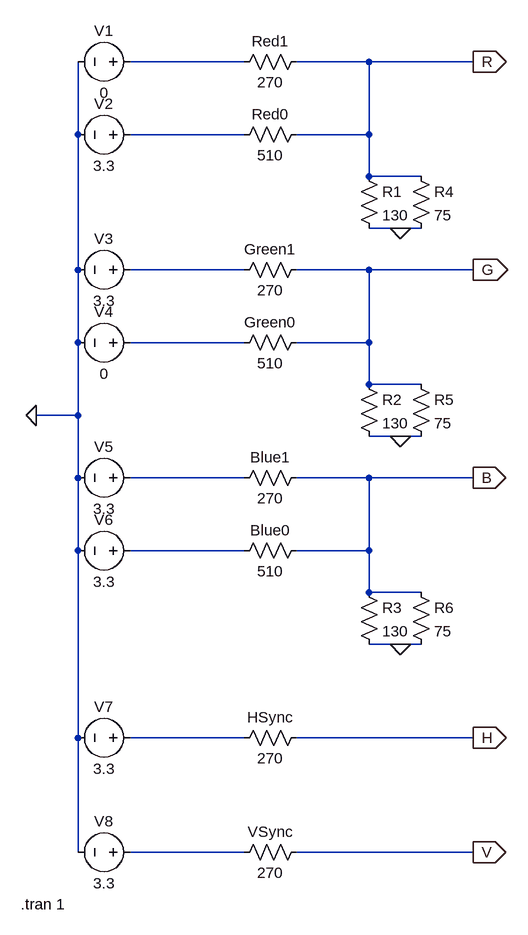
[diagram p0: schematic R-2R_DAC.asc]
R-2R_DAC.asc, the LTspice schematic file:
Version 4
SHEET 1 908 680
WIRE -112 -720 -288 -720
WIRE 80 -720 -32 -720
WIRE 240 -720 80 -720
WIRE -368 -608 -368 -720
WIRE -112 -608 -288 -608
WIRE 80 -608 80 -720
WIRE 80 -608 -32 -608
WIRE 80 -544 80 -608
WIRE 160 -544 80 -544
WIRE 128 -464 80 -464
WIRE 160 -464 128 -464
WIRE -368 -400 -368 -608
WIRE -112 -400 -288 -400
WIRE 80 -400 -32 -400
WIRE 240 -400 80 -400
WIRE -368 -288 -368 -400
WIRE -112 -288 -288 -288
WIRE 80 -288 80 -400
WIRE 80 -288 -32 -288
WIRE 80 -224 80 -288
WIRE 160 -224 80 -224
WIRE -368 -176 -368 -288
WIRE -368 -176 -432 -176
WIRE 128 -144 80 -144
WIRE 160 -144 128 -144
WIRE -368 -80 -368 -176
WIRE -112 -80 -288 -80
WIRE 80 -80 -32 -80
WIRE 240 -80 80 -80
WIRE -368 32 -368 -80
WIRE -112 32 -288 32
WIRE 80 32 80 -80
WIRE 80 32 -32 32
WIRE 80 96 80 32
WIRE 160 96 80 96
WIRE 128 176 80 176
WIRE 160 176 128 176
WIRE -368 320 -368 32
WIRE -112 320 -288 320
WIRE 240 320 -32 320
WIRE -368 496 -368 320
WIRE -112 496 -288 496
WIRE 240 496 -32 496
FLAG 240 -720 R
IOPIN 240 -720 Out
FLAG 240 -400 G
IOPIN 240 -400 Out
FLAG 240 -80 B
IOPIN 240 -80 Out
FLAG 240 320 H
IOPIN 240 320 Out
FLAG 240 496 V
IOPIN 240 496 Out
FLAG -432 -176 0
FLAG 128 -464 0
FLAG 128 -144 0
FLAG 128 176 0
SYMBOL res -16 -736 R90
WINDOW 0 0 56 VBottom 2
WINDOW 3 32 56 VTop 2
SYMATTR InstName Red1
SYMATTR Value 270
SYMBOL res -16 -624 R90
WINDOW 0 0 56 VBottom 2
WINDOW 3 32 56 VTop 2
SYMATTR InstName Red0
SYMATTR Value 510
SYMBOL res 64 -560 R0
SYMATTR InstName R1
SYMATTR Value 130
SYMBOL res -16 -416 R90
WINDOW 0 0 56 VBottom 2
WINDOW 3 32 56 VTop 2
SYMATTR InstName Green1
SYMATTR Value 270
SYMBOL res -16 -304 R90
WINDOW 0 0 56 VBottom 2
WINDOW 3 32 56 VTop 2
SYMATTR InstName Green0
SYMATTR Value 510
SYMBOL res 64 -240 R0
SYMATTR InstName R2
SYMATTR Value 130
SYMBOL res -16 -96 R90
WINDOW 0 0 56 VBottom 2
WINDOW 3 32 56 VTop 2
SYMATTR InstName Blue1
SYMATTR Value 270
SYMBOL res -16 16 R90
WINDOW 0 0 56 VBottom 2
WINDOW 3 32 56 VTop 2
SYMATTR InstName Blue0
SYMATTR Value 510
SYMBOL res 64 80 R0
SYMATTR InstName R3
SYMATTR Value 130
SYMBOL res -16 304 R90
WINDOW 0 0 56 VBottom 2
WINDOW 3 32 56 VTop 2
SYMATTR InstName HSync
SYMATTR Value 270
SYMBOL res -16 480 R90
WINDOW 0 0 56 VBottom 2
WINDOW 3 32 56 VTop 2
SYMATTR InstName VSync
SYMATTR Value 270
SYMBOL voltage -272 -720 R90
WINDOW 0 -32 56 VBottom 2
WINDOW 3 32 56 VTop 2
SYMATTR InstName V1
SYMATTR Value 0
SYMBOL voltage -272 -608 R90
WINDOW 0 -32 56 VBottom 2
WINDOW 3 32 56 VTop 2
SYMATTR InstName V2
SYMATTR Value 3.3
SYMBOL voltage -272 -400 R90
WINDOW 0 -32 56 VBottom 2
WINDOW 3 32 56 VTop 2
SYMATTR InstName V3
SYMATTR Value 3.3
SYMBOL voltage -272 -288 R90
WINDOW 0 -32 56 VBottom 2
WINDOW 3 32 56 VTop 2
SYMATTR InstName V4
SYMATTR Value 0
SYMBOL voltage -272 -80 R90
WINDOW 0 -32 56 VBottom 2
WINDOW 3 32 56 VTop 2
SYMATTR InstName V5
SYMATTR Value 3.3
SYMBOL voltage -272 32 R90
WINDOW 0 -32 56 VBottom 2
WINDOW 3 32 56 VTop 2
SYMATTR InstName V6
SYMATTR Value 3.3
SYMBOL voltage -272 320 R90
WINDOW 0 -32 56 VBottom 2
WINDOW 3 32 56 VTop 2
SYMATTR InstName V7
SYMATTR Value 3.3
SYMBOL voltage -272 496 R90
WINDOW 0 -32 56 VBottom 2
WINDOW 3 32 56 VTop 2
SYMATTR InstName V8
SYMATTR Value 3.3
SYMBOL res 144 -560 R0
SYMATTR InstName R4
SYMATTR Value 75
SYMBOL res 144 -240 R0
SYMATTR InstName R5
SYMATTR Value 75
SYMBOL res 144 80 R0
SYMATTR InstName R6
SYMATTR Value 75
TEXT -456 576 Left 2 !.tran 1

The netlist it stands for:
* R-2R_DAC.asc
Red1 R N001 270
Red0 R N002 510
R1 R 0 130
R§Green1 G N003 270
R§Green0 G N004 510
R2 G 0 130
R§Blue1 B N005 270
R§Blue0 B N006 510
R3 B 0 130
R§HSync H N007 270
R§VSync V N008 270
V1 N001 0 0
V2 N002 0 3.3
V3 N003 0 3.3
V4 N004 0 0
V5 N005 0 3.3
V6 N006 0 3.3
V7 N007 0 3.3
V8 N008 0 3.3
R4 R 0 75
R5 G 0 75
R6 B 0 75
.tran 1
.backanno
.end

* Results of the author's LTspice run, read from the files saved beside the schematic
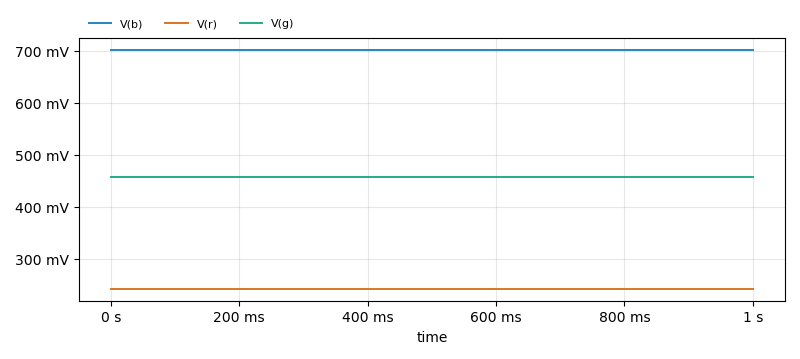
[diagram p1: Transient Analysis of R-2R_DAC.asc, plotted from the saved traces]
* Transient Analysis, 1 run:
*   V(b): min 700.4 mV, max 700.4 mV, average 700.4 mV, rms 700.4 mV, last 700.4 mV
*   V(r): min 242.4 mV, max 242.4 mV, average 242.4 mV, rms 242.4 mV, last 242.4 mV
*   V(g): min 457.9 mV, max 457.9 mV, average 457.9 mV, rms 457.9 mV, last 457.9 mV